# Altium project 200415 Brake Module R5.PrjPcb
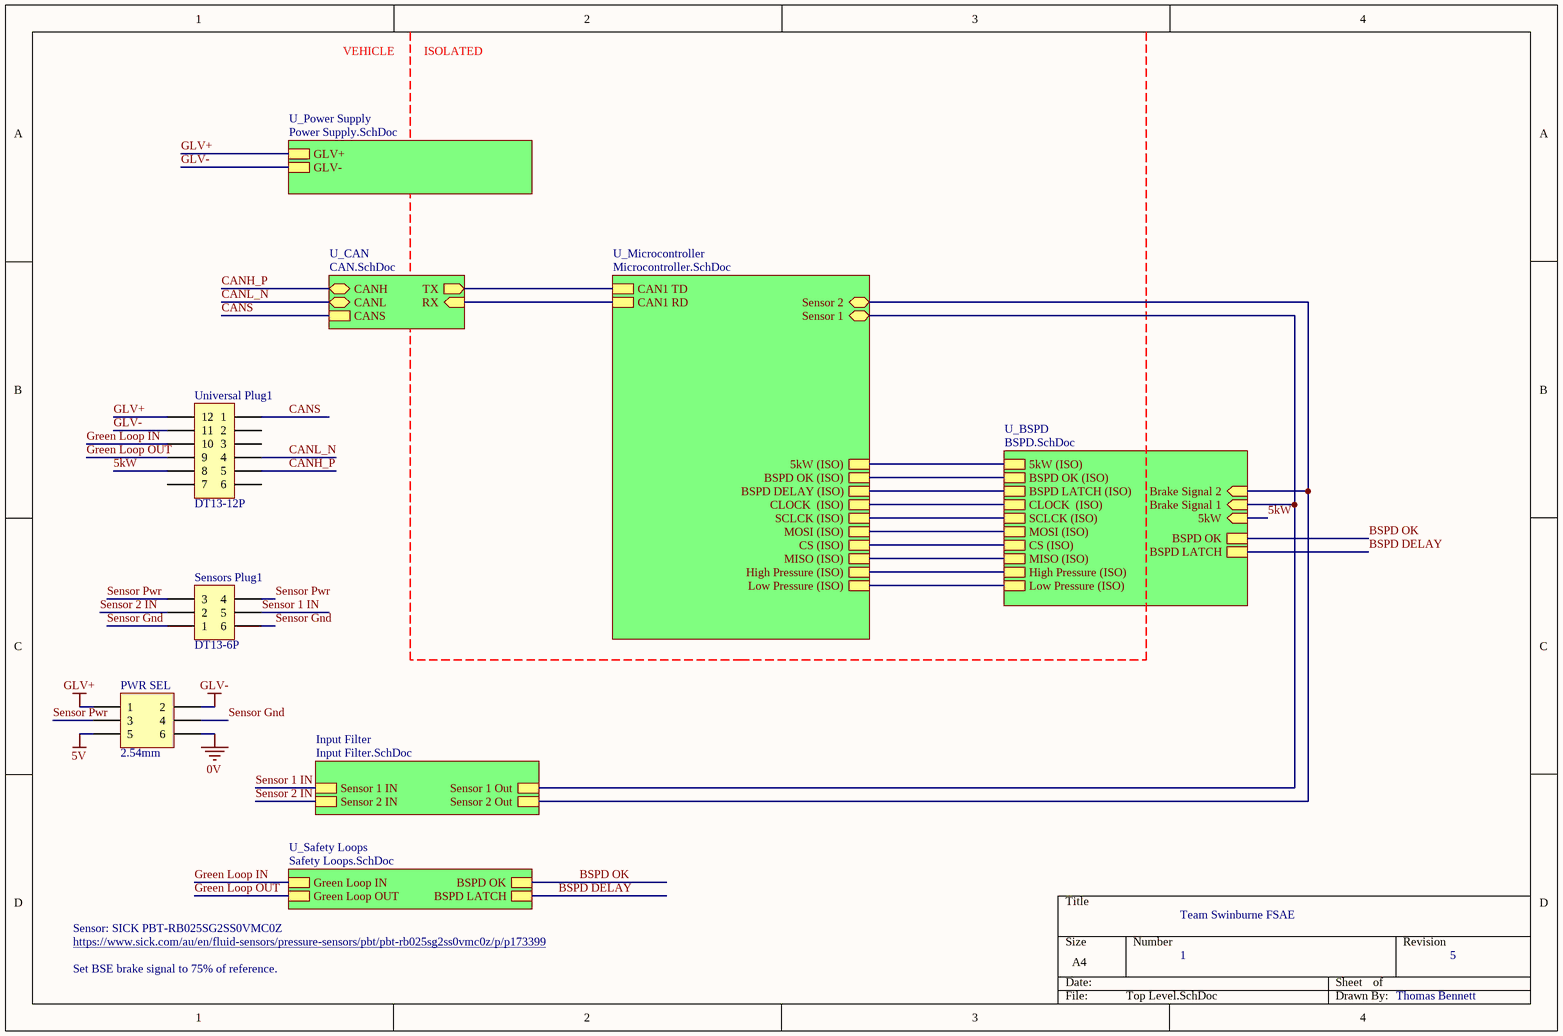
[diagram p0: Top Level.SchDoc]
_date: 06/05/2020; _designer: Thomas Bennett; _oganisation: Team Swinburne FSAE; _revision: 5
7 sheets, 139 parts. Net scope: hierarchical (ports join the sheet entries above them; power ports are global).
Board files: Brake Module PCB R5.PcbDoc, Brake Module R6.PcbDoc
Sheets:
  Top Level.SchDoc
    U_BSPD = BSPD.SchDoc
    U_Microcontroller = Microcontroller.SchDoc
    U_Safety Loops = Safety Loops.SchDoc
    U_Power Supply = Power Supply.SchDoc
    U_CAN = CAN.SchDoc
    Input Filter = Input Filter.SchDoc

## Sheet Top Level.SchDoc
size A4

### Parts
PWR_SEL  2.54mm  [TH 2.54mm Header 2x3]
Sensors_Plug1  DT13-6P  [DT13-6P]
Universal_Plug1  DT13-12P  [DT13-12P]

### Sub-sheets
Input Filter = Input Filter.SchDoc: Sensor 2 IN, Sensor 1 IN, Sensor 2 Out, Sensor 1 Out
U_BSPD = BSPD.SchDoc: BSPD OK (ISO), MOSI (ISO), SCLCK (ISO), 5kW (ISO), Brake Signal 1 (in), Brake Signal 2 (in), BSPD LATCH (ISO), 5kW (in), CLOCK  (ISO), CS (ISO), High Pressure (ISO), Low Pressure (ISO), BSPD OK, BSPD LATCH, MISO (ISO)
U_CAN = CAN.SchDoc: CANS, RX (in), CANL (bidir), CANH (bidir), TX (out)
U_Microcontroller = Microcontroller.SchDoc: BSPD OK (ISO), 5kW (ISO), Sensor 2 (bidir), Sensor 1 (bidir), BSPD DELAY (ISO), CAN1 RD, CAN1 TD, CLOCK  (ISO), High Pressure (ISO), Low Pressure (ISO), MISO (ISO), CS (ISO), MOSI (ISO), SCLCK (ISO)
U_Power Supply = Power Supply.SchDoc: GLV+, GLV-
U_Safety Loops = Safety Loops.SchDoc: Green Loop OUT, Green Loop IN, BSPD OK, BSPD LATCH

### Nets
0V: PWR_SEL.6
5V: PWR_SEL.5
GLV+: PWR_SEL.1 Universal_Plug1.12 ; sheet U_Power Supply/GLV+
GLV-: PWR_SEL.2 Universal_Plug1.11 ; sheet U_Power Supply/GLV-
5kW: Universal_Plug1.8 ; sheet U_BSPD/5kW
Brake Signal 1: sheet U_BSPD/Brake Signal 1, sheet U_Microcontroller/Sensor 1, sheet Input Filter/Sensor 1 Out
Brake Signal 2: sheet U_BSPD/Brake Signal 2, sheet U_Microcontroller/Sensor 2, sheet Input Filter/Sensor 2 Out
BSPD DELAY: sheet U_BSPD/BSPD LATCH, sheet U_Safety Loops/BSPD LATCH
BSPD OK: sheet U_BSPD/BSPD OK, sheet U_Safety Loops/BSPD OK
CANH_P: Universal_Plug1.5 ; sheet U_CAN/CANH
CANL_N: Universal_Plug1.4 ; sheet U_CAN/CANL
CANS: Universal_Plug1.1 ; sheet U_CAN/CANS
Green Loop IN: Universal_Plug1.10 ; sheet U_Safety Loops/Green Loop IN
Green Loop OUT: Universal_Plug1.9 ; sheet U_Safety Loops/Green Loop OUT
Sensor 1 IN: Sensors_Plug1.5 ; sheet Input Filter/Sensor 1 IN
Sensor 2 IN: Sensors_Plug1.2 ; sheet Input Filter/Sensor 2 IN
Sensor Gnd: PWR_SEL.4 Sensors_Plug1.1 Sensors_Plug1.6
Sensor Pwr: PWR_SEL.3 Sensors_Plug1.3 Sensors_Plug1.4
NetR13_1: sheet U_BSPD/MISO (ISO), sheet U_Microcontroller/MISO (ISO)
NetR14_1: sheet U_BSPD/MOSI (ISO), sheet U_Microcontroller/MOSI (ISO)
NetR15_1: sheet U_BSPD/SCLCK (ISO), sheet U_Microcontroller/SCLCK (ISO)
NetR16_1: sheet U_BSPD/CS (ISO), sheet U_Microcontroller/CS (ISO)
NetU1_4: sheet U_Microcontroller/CAN1 RD, sheet U_CAN/RX
NetU1_5: sheet U_Microcontroller/CAN1 TD, sheet U_CAN/TX
NetU5_11: sheet U_BSPD/BSPD OK (ISO), sheet U_Microcontroller/BSPD OK (ISO)
NetU5_13: sheet U_BSPD/CLOCK  (ISO), sheet U_Microcontroller/CLOCK  (ISO)
NetU5_14: sheet U_BSPD/BSPD LATCH (ISO), sheet U_Microcontroller/BSPD DELAY (ISO)
NetU6_11: sheet U_BSPD/Low Pressure (ISO), sheet U_Microcontroller/Low Pressure (ISO)
NetU6_13: sheet U_BSPD/High Pressure (ISO), sheet U_Microcontroller/High Pressure (ISO)
NetU6_14: sheet U_BSPD/5kW (ISO), sheet U_Microcontroller/5kW (ISO)

Not connected (* = marked no-connect by the designer): Universal_Plug1 2 3 6 7

### Notes on the sheet
- VEHICLE
- ISOLATED
- Sensor: SICK PBT-RB025SG2SS0VMC0Z
- https://www.sick.com/au/en/fluid-sensors/pressure-sensors/pbt/pbt-rb025sg2ss0vmc0z/p/p173399
- Set BSE brake signal to 75% of reference.
- 1

### Library data of the parts
PWR_SEL = TH 2.54mm Header 2x3: Positions: 6; Angle: 0; Flange: No; Contact: NA; Part Number: TH 2.54mm Header 2x3; Pitch: 2.54mm; Row Spacing: 2.54mm
Sensors_Plug1 = DT13-6P[[/\]]DT13-6P: Positions: 6; Pitch: 4.44mm; Row Spacing: 6.35mm; Angle: 90; Flange: Yes; Contact: Copper Alloy; Part Number: DT13-6P; Digikey Part Number: 1734-1025-ND; Digikey Link: https://www.digikey.com/product-detail/en/te-connectivity-deutsch-connectors/DT13-6P/1734-1025-ND/6566589
Universal_Plug1 = DT13-12P[[/\]]DT13-12P: Positions: 12; Pitch: 4.44mm; Row Spacing: 6.35mm; Angle: 90; Flange: Yes; Contact: Nickel; Part Number: DT13-12P; Digikey Part Number: 1734-1451-ND; Digikey Link: https://www.digikey.com.au/product-detail/en/te-connectivity-deutsch-connectors/DT13-12PA/1734-1451-ND/7220123

## Sheet BSPD.SchDoc: BSPD
size A3; DocumentNumber: 2; Revision: R5; SheetNumber: 2
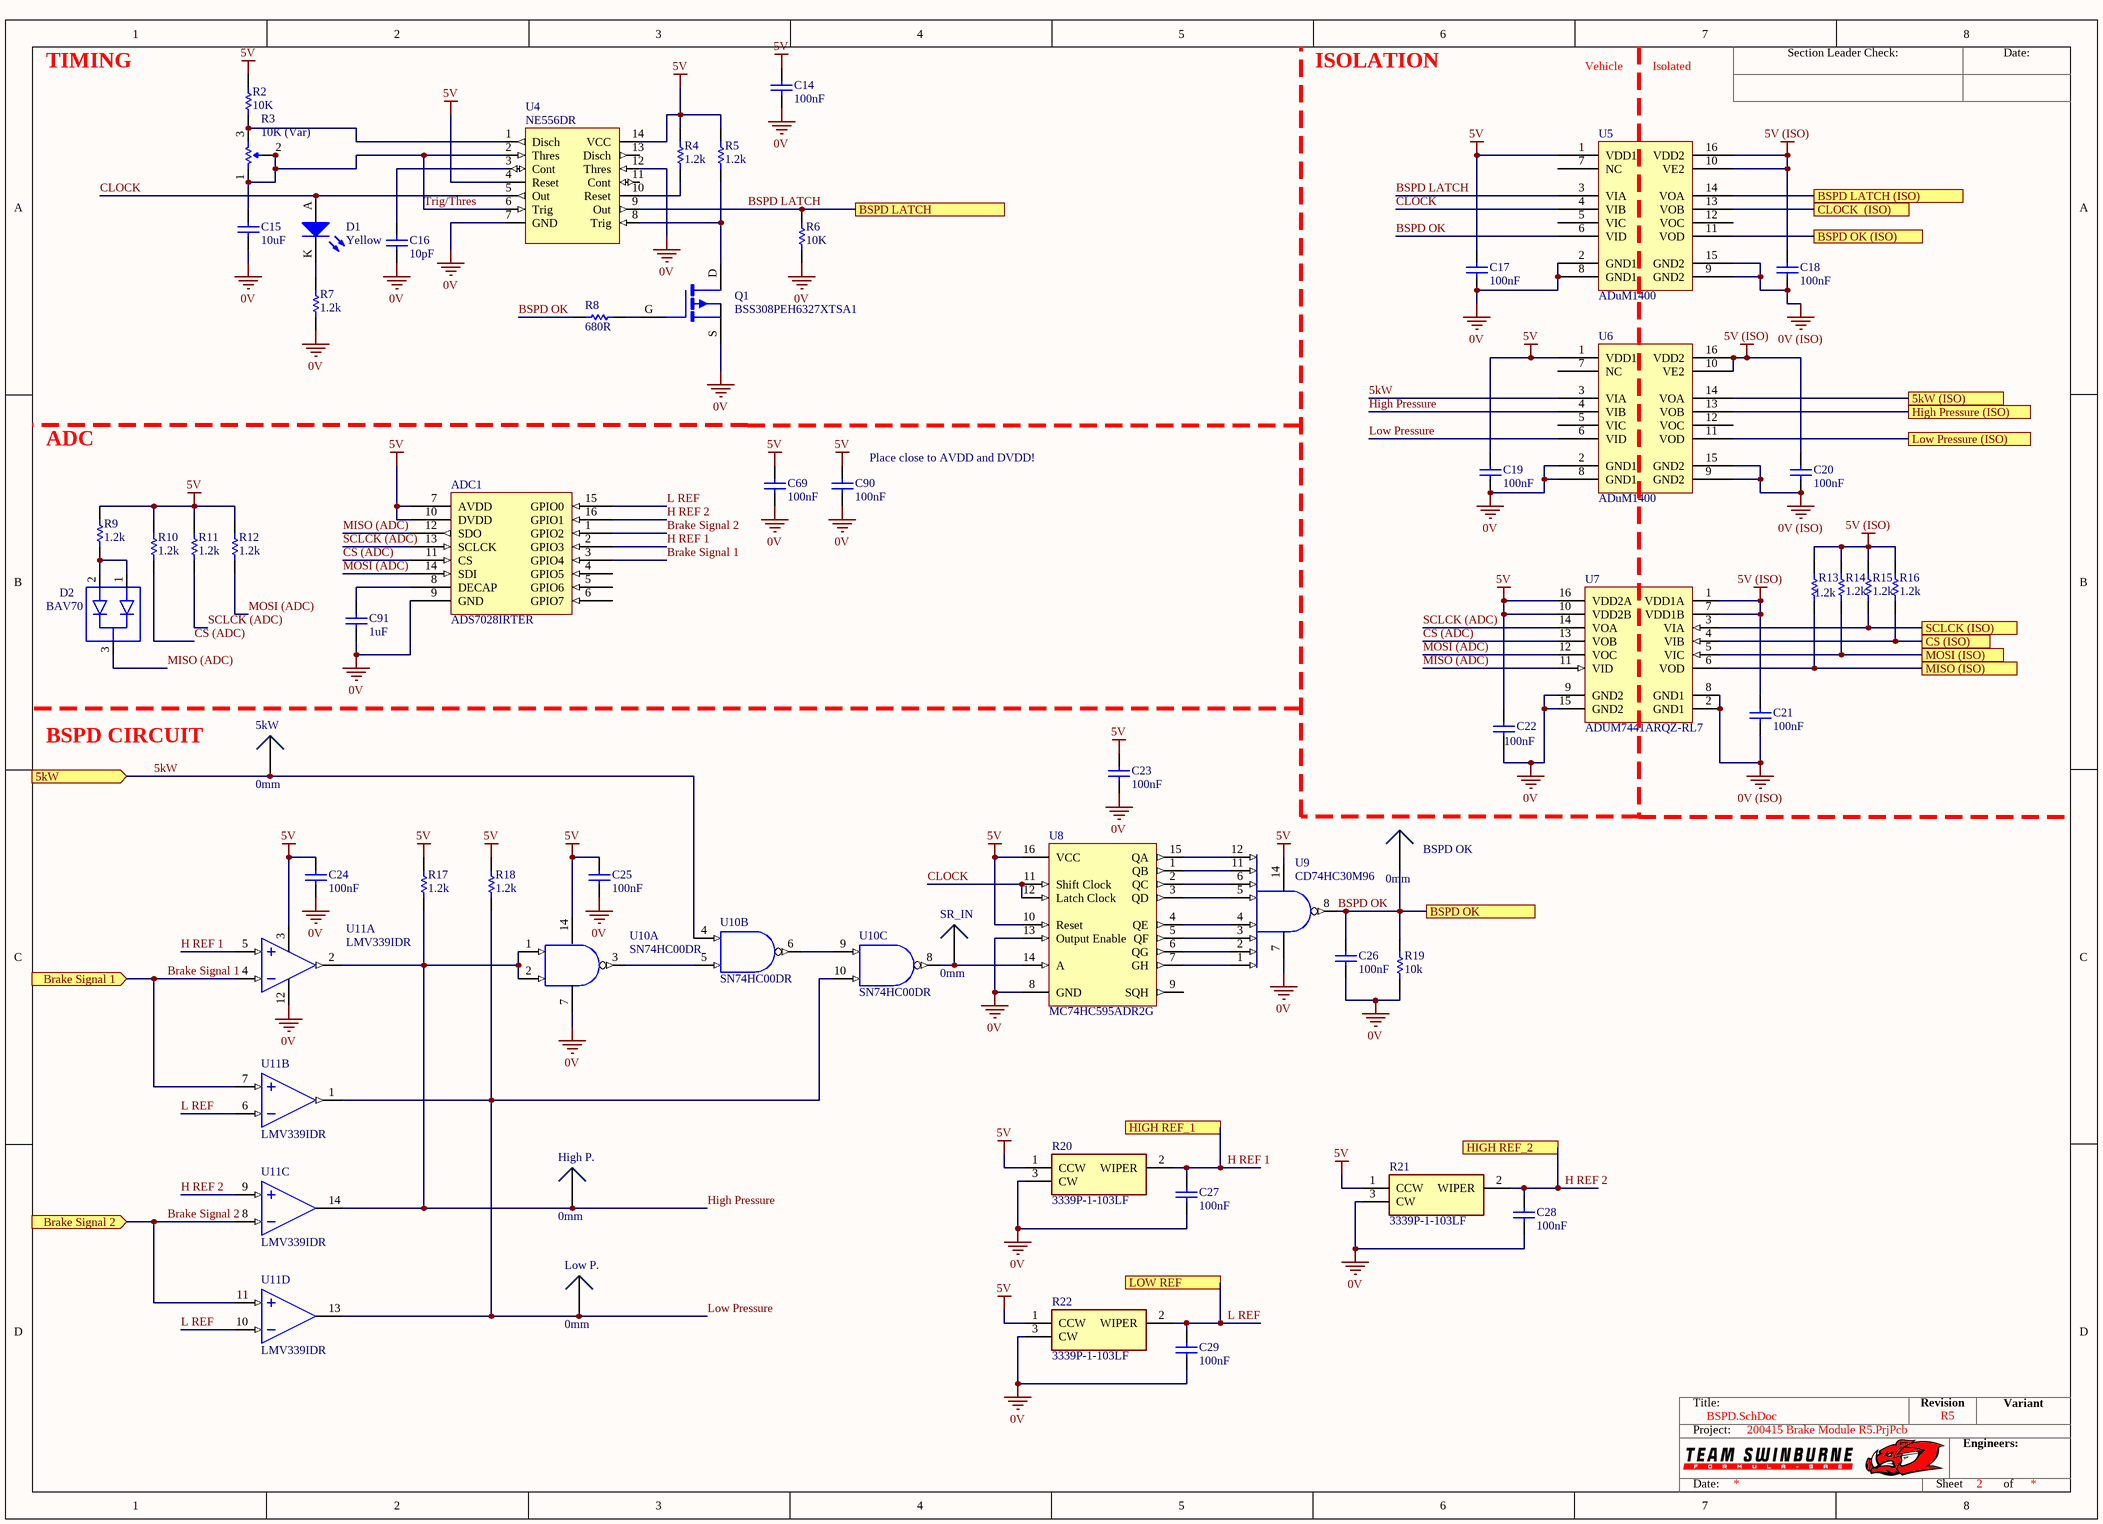
[diagram p1: BSPD.SchDoc]

### Parts
5kW  0mm  [SMD Test Point]
ADC1  ADS7028IRTER  [WFQN-16]
BSPD_OK  0mm  [SMD Test Point]
C14  100nF  [C0603]
C15  10uF  [C0603]
C16  10pF  [C0603]
C17  100nF  [C0603]
C18  100nF  [C0603]
C19  100nF  [C0603]
C20  100nF  [C0603]
C21  100nF  [C0603]
C22  100nF  [C0603]
C23  100nF  [C0603]
C24  100nF  [C0603]
C25  100nF  [C0603]
C26  100nF  [C0603]
C27  100nF  [0805]
C28  100nF  [0805]
C29  100nF  [0805]
C69  100nF  [C0603]
C90  100nF  [C0603]
C91  1uF  [0603]
D1  Yellow  [0805 LED]
D2  BAV70  [BAV70-Footprint-1]
High_P.  0mm  [SMD Test Point]
Low_P.  0mm  [SMD Test Point]
Q1  BSS308PEH6327XTSA1  [IN SOT-23 MOSFET]
R2  10K  [R0603]
R3  10K (Var)  [B 3296]
R4  1.2k  [R0603]
R5  1.2k  [R0603]
R6  10K  [R0603]
R7  1.2k  [R0603]
R8  680R  [R0603]
R9  1.2k  [R0603]
R10  1.2k  [R0603]
R11  1.2k  [R0603]
R12  1.2k  [R0603]
R13  1.2k  [R0603]
R14  1.2k  [R0603]
R15  1.2k  [R0603]
R16  1.2k  [R0603]
R17  1.2k  [R0603]
R18  1.2k  [R0603]
R19  10k  [0805]
R20  3339P-1-103LF  [3339P1103LF]
R21  3339P-1-103LF  [3339P1103LF]
R22  3339P-1-103LF  [3339P1103LF]
SR_IN  0mm  [SMD Test Point]
U4  NE556DR  [14 SOIC]
U5  ADuM1400  [SOIC16-W]
U6  ADuM1400  [SOIC16-W]
U7  ADUM7441ARQZ-RL7  [ADI-RQ-16_M]
U8  MC74HC595ADR2G  [ON 16-SOIC]
U9  CD74HC30M96  [TI 14-SOIC]
U10  SN74HC00DR  [TI 14-SOIC]  (parts A,B,C of 4)
U11  LMV339IDR  [TI 14-SOIC]  (parts A,B,C,D of 4)

### Ports
5kW (in), 5kW (ISO), Brake Signal 1 (in), Brake Signal 2 (in), BSPD LATCH, BSPD LATCH (ISO), BSPD OK, BSPD OK (ISO), CLOCK  (ISO), CS (ISO), High Pressure (ISO), HIGH REF_1, HIGH REF_2, Low Pressure (ISO), LOW REF, MISO (ISO), MOSI (ISO), SCLCK (ISO)

### Nets
0V: ADC1.9(GND) C14.1 C15.1 C16.1 C17.1 C19.1 C22.1 C23.1 C24.1 C25.1 C26.1 C27.1 C28.1 C29.1 C69.1 C90.1 C91.1 Q1.S R6.1 R7.1 R19.1 R20.3(CW) R21.3(CW) R22.3(CW) U4.7(GND) U4.12(Thres) U5.2(GND1) U5.8(GND1) U6.2(GND1) U6.8(GND1) U7.9(GND2) U7.15(GND2) U8.8(GND) U8.13(Output_Enable) U9.7(GND) U10.7(GND) U11.12(V-)
0V (ISO): C18.1 C20.1 C21.1 U5.9(GND2) U5.15(GND2) U6.9(GND2) U6.15(GND2) U7.2(GND1) U7.8(GND1)
5V: ADC1.7(AVDD) ADC1.10(DVDD) C14.2 C17.2 C19.2 C22.2 C23.2 C24.2 C25.2 C69.2 C90.2 R2.2 R4.2 R5.2 R9.2 R10.2 R11.2 R12.2 R17.2 R18.2 R20.1(CCW) R21.1(CCW) R22.1(CCW) U4.4(Reset) U4.14(VCC) U5.1(VDD1) U6.1(VDD1) U7.10(VDD2B) U7.16(VDD2A) U8.10(Reset) U8.16(VCC) U9.14(VCC) U10.14(VCC) U11.3(V+)
5V (ISO): C18.2 C20.2 C21.2 R13.2 R14.2 R15.2 R16.2 U5.10(VE2) U5.16(VDD2) U6.10(VE2) U6.16(VDD2) U7.1(VDD1A) U7.7(VDD1B)
5kW: 5kW.1 U6.3(VIA) U10.4(2A) ; port 5kW
Brake Signal 1: ADC1.3(GPIO4) U11.4(IN_A-) U11.7(IN_B+) ; port Brake Signal 1
Brake Signal 2: ADC1.1(GPIO2) U11.8(IN_C-) U11.11(IN_D+) ; port Brake Signal 2
BSPD LATCH: R6.2 U4.9(Out) U5.3(VIA) ; port BSPD LATCH  [project net BSPD DELAY]
BSPD OK: BSPD_OK.1 C26.2 R8.1 R19.2 U5.6(VID) U9.8(Output) ; port BSPD OK
CLOCK: D1.A U4.5(Out) U5.4(VIB) U8.11(Shift_Clock) U8.12(Latch_Clock)
CS (ADC): ADC1.11(CS) R10.1 U7.13(VOB)
H REF 1: ADC1.2(GPIO3) C27.2 R20.2(WIPER) U11.5(IN_A+) ; port HIGH REF_1
H REF 2: ADC1.16(GPIO1) C28.2 R21.2(WIPER) U11.9(IN_C+) ; port HIGH REF_2
High Pressure: High_P..1 R17.1 U6.4(VIB) U10.1(1A) U10.2(1B) U11.2(OUT_A) U11.14(OUT_C)
L REF: ADC1.15(GPIO0) C29.2 R22.2(WIPER) U11.6(IN_B-) U11.10(IN_D-) ; port LOW REF
Low Pressure: Low_P..1 R18.1 U6.6(VID) U10.10(3B) U11.1(OUT_B) U11.13(OUT_D)
MISO (ADC): ADC1.12(SDO) D2.3(CC) U7.11(VID)
MOSI (ADC): ADC1.14(SDI) R12.1 U7.12(VOC)
SCLCK (ADC): ADC1.13(SCLCK) R11.1 U7.14(VOA)
Trig/Thres: C15.2 R3.1(CCW) R3.2(Wiper) U4.2(Thres) U4.6(Trig)
NetADC1_8: ADC1.8(DECAP) C91.2
NetC16_2: C16.2 U4.3(Cont)
NetD1_K: D1.K R7.2
NetD2_1: D2.1(A1) D2.2(A2) R9.1
NetQ1_D: Q1.D R5.1 U4.8(Trig)
NetQ1_G: Q1.G R8.2
NetR2_1: R2.1 R3.3(CW) U4.1(Disch)
NetR4_1: R4.1 U4.10(Reset)
NetR13_1: R13.1 U7.6(VOD) ; port MISO (ISO)
NetR14_1: R14.1 U7.5(VIC) ; port MOSI (ISO)
NetR15_1: R15.1 U7.3(VIA) ; port SCLCK (ISO)
NetR16_1: R16.1 U7.4(VIB) ; port CS (ISO)
NetSR_IN_1: SR_IN.1 U8.14(A) U10.8(3Y)
NetU5_11: U5.11(VOD) ; port BSPD OK (ISO)
NetU5_13: U5.13(VOB) ; port CLOCK  (ISO)
NetU5_14: U5.14(VOA) ; port BSPD LATCH (ISO)
NetU6_11: U6.11(VOD) ; port Low Pressure (ISO)
NetU6_13: U6.13(VOB) ; port High Pressure (ISO)
NetU6_14: U6.14(VOA) ; port 5kW (ISO)
NetU8_1: U8.1(QB) U9.11(Input)
NetU8_2: U8.2(QC) U9.6(Input)
NetU8_3: U8.3(QD) U9.5(Input)
NetU8_4: U8.4(QE) U9.4(Input)
NetU8_5: U8.5(QF) U9.3(Input)
NetU8_6: U8.6(QG) U9.2(Input)
NetU8_7: U8.7(GH) U9.1(Input)
NetU8_15: U8.15(QA) U9.12(Input)
NetU10_3: U10.3(1Y) U10.5(2B)
NetU10_6: U10.6(2Y) U10.9(3A)

Not connected (* = marked no-connect by the designer): ADC1 4(GPIO5) 5(GPIO6) 6(GPIO7); U4 11(Cont) 13(Disch); U5 5(VIC) 7(NC) 12(VOC); U6 5(VIC) 7(NC) 12(VOC); U8 9(SQH)

### Notes on the sheet
- TIMING
- ISOLATION
- Vehicle
- Isolated
- ADC
- (near C90) Place close to AVDD and DVDD!
- BSPD CIRCUIT
- Section Leader Check:
- Date:
- Title:
- Revision
- Variant
- Project:
- Engineers:
- Sheet
- of

### Library data of the parts
5kW BSPD_OK High_P. Low_P. SR_IN = SMD Test Point: Positions: 1; Row Spacing: 0; Flange: No; Contact: NA; Part Number: SMD Test Point; Pitch: 0mm; Angle: 0
ADC1 = ADS7028IRTER: IC ADC 12BIT SAR 16WQFN; Manufacturer: Texas Instruments; Part Number: ADS7028IRTER; Digikey Part Number: ADS7028IRTER; Digikey Link: https://www.digikey.com.au/en/products/detail/texas-instruments/ADS7028IRTER/12696020?s=N4IgTCBcDaIIIBEDKB2ADGAHASQEoBUBRXEAXQF8g
C14 C17-C26 C69 C90 = CC0603ZPY5V9BB104: Tolerance: 5%; Material: C0G; Rated Voltage: 50V; Part Number: CC0603ZPY5V9BB104; Value: 100nF; Digikey Link: #https://www.digikey.com.au/en/products/detail/yageo/CC0603ZPY5V9BB104/11490657#
C15 = GRM188R6YA106MA73D: Tolerance: 20%; Material: X5R; Rated Voltage: 35V; Part Number: GRM188R6YA106MA73D; Value: 10uF; Digikey Link: #https://www.digikey.com.au/en/products/detail/murata-electronics/GRM188R6YA106MA73D/5877411#
C16 = CC0603JPNPO9BN100: Tolerance: 5%; Material: C0G; Rated Voltage: 50V; Part Number: CC0603JPNPO9BN100; Value: 10pF; Digikey Link: #https://www.digikey.com.au/en/products/detail/yageo/CC0603JPNPO9BN100/11491009#
C27-C29 = GCM21BR71H104KA37L: Manufacturer: muRata; Tolerance: ±10%; Material: X7R; Rated Voltage: 50V; Part Number: GCM21BR71H104KA37L; Value: 100nF; Digikey Part Number: 490-6064-1-ND
C91 = GRT188R61H105ME13D: Manufacturer: muRata; Tolerance: 20%; Material: X5R; Rated Voltage: 50V; Part Number: GRT188R61H105ME13D; Value: 1uF; Digikey Part Number: GRT188R61H105ME13D
D1 = SML-211YTT86: Yellow LED Indication - Discrete 1.75V 0805 (2012 Metric); Manufacturer: ROHM Semiconductor; Part Number: SML-211YTT86; Colour: Yellow; Digikey Part Number: 511-1293-1-ND; Digikey Link: https://www.digikey.com/product-detail/en/rohm-semiconductor/SML-211YTT86/511-1293-1-ND/637106
D2 = CMP-004-00001-1: DIODE ARRAY GP 70V 200mA SOT23-3; RoHS Compliant: No
Q1 = BSS308PEH6327XTSA1: P-Channel 30V 2A (Ta) 500mW (Ta) Surface Mount SOT-23-3; Manufacturer: Infineon Technologies; Published: 24-Mar-1999; LatestRevisionDate: 29-May-2009; LatestRevisionNote: IPC-7351 Footprint Added.; PackageVersion: Sep-2000; PackageReference: SOT-343; Publisher: Altium Limited; PackageDescription: 4-Pin SOT-343 Package 1.3 mm Pitch, 2.1 mm Lead Span; Part Number: BSS308PEH6327XTSA1; Digikey Part Number: BSS308PEH6327XTSA1CT-ND; Digikey Link: https://www.digikey.com/product-detail/en/infineon-technologies/BSS308PEH6327XTSA1/BSS308PEH6327XTSA1CT-ND/3196649
R2 R6 = RA73F1J10KBTD: Tolerance: 0.1%; Part Number: RA73F1J10KBTD; Value: 10K; Material: Thin Film; Digikey Link: #https://www.digikey.com.au/en/products/detail/te-connectivity-passive-product/RA73F1J10KBTD/16031729#
R3 = 3296W-1-103LF: Manufacturer: Bournes Inc; Tolerance: 0.1; Rated Voltage: 0.5W; Part Number: 3296W-1-103LF; Value: 10K (Var); Digikey Part Number: 3296W-103LF-ND
R4 R5 R7 R9-R18 = ERJ-PA3J122V: Tolerance: 1%; Part Number: ERJ-PA3J122V; Value: 1.2k; Material: Thick Film; Digikey Link: #https://www.digikey.com.au/en/products/detail/panasonic-electronic-components/ERJ-PA3J122V/5035981#
R8 = RCP0603B680RGEA: Tolerance: 2%; Part Number: RCP0603B680RGEA; Value: 680R; Material: Thick Film; Digikey Link: #https://www.digikey.com.au/en/products/detail/vishay-dale/RCP0603B680RGEA/5791729#
R19 = RC0805FR0710KL: Manufacturer: YAGEO; Tolerance: 0.01; Rated Voltage: 0.125W; Part Number: RC0805FR0710KL; Value: 10k; Material: FR-07; Digikey Part Number: 311-10.0KCRCT-ND
R20-R22 = 3339P-1-103LF: Variable Resistor; Manufacturer_Name: Bourns; Datasheet Link: http://www.bourns.com/docs/Product-Datasheets/3339.pdf; Height: 6.6mm; Manufacturer_Part_Number: 3339P-1-103LF; Mouser Part Number: 652-3339P-1-103LF; Mouser Price/Stock: https://www.mouser.co.uk/ProductDetail/Bourns/3339P-1-103LF?qs=pSi0RBzb0oq3DckZs1IQyg%3D%3D; Arrow Part Number: 3339P-1-103LF; Arrow Price/Stock: https://www.arrow.com/en/products/3339p-1-103lf/bourns?region=nac
U4 = NE556DR: IC OSC TIMER DUAL 100KHZ 14SOIC; Manufacturer: Texas Instruments; Part Number: NE556DR; Digikey Part Number: 296-26240-1-ND; Digikey Link: https://www.digikey.com/product-detail/en/texas-instruments/NE556DR/296-26240-1-ND/2254905
U5 U6 = ADuM1400: DIGITAL ISOLATOR, QUAD CHANNEL; Part Number: ADuM1400; Digikey Link: #https://www.analog.com/media/en/technical-documentation/data-sheets/ADuM1400_1401_1402.pdf#
U7 = CMP-001-0005-5: Digital Isolator CMOS 4-CH 1Mbps 16-Pin QSOP T/R; Pulse Width Distortion (PWD): 25ns; Nominal Supply Current: 4.1mA; Data Rate: 25Mbps; Turn-On Delay Time: 56ns; Max Supply Voltage: 5.5V; Isolated Power: No; Min Supply Voltage: 3V; Propagation Delay: 75ns; Channel Type: Unidirectional; Number of Channels: 4; Lead Free: Contains Lead; Number of Pins: 16; Contact Plating: Tin,Matte; RoHS Compliant: Yes; Package Quantity: 1000; Type: General Purpose; Supply Current: 4.1mA; Case/Package: QSOP; Max Operating Temperature: 105°C; Packaging: Tape and Reel; Series: iCoupler®; Min Operating Temperature: -40°C
U8 = MC74HC595ADR2G: IC SHIFT REGISTR 8BIT 3ST 16SOIC; Manufacturer: ON Semiconductor; Part Number: MC74HC595ADR2G; Digikey Part Number: MC74HC595ADR2GOSCT-ND; Digikey Link: https://www.digikey.com/product-detail/en/on-semiconductor/MC74HC595ADR2G/MC74HC595ADR2GOSCT-ND/1139727
U9 = CD74HC30M96: IC GATE NAND 1CH 8-INP 14SOIC; Manufacturer: Texas Instruments; Part Number: CD74HC30M96; Digikey Part Number: 296-14521-1-ND; Digikey Link: https://www.digikey.com/product-detail/en/texas-instruments/CD74HC30M96/296-14521-1-ND/555580
U10 = SN74HC00DR: NAND Gate IC 4 Channel 14-SOIC; Manufacturer: Texas Instruments; Part Number: SN74HC00DR; Digikey Part Number: 296-1187-2-ND; Digikey Link: https://www.digikey.com.au/product-detail/en/texas-instruments/SN74HC00DR/296-1187-2-ND/276830
U11 = LMV339IDR: Comparator General Purpose Open Collector 14-SOIC; Manufacturer: Texas Instruments; Part Number: LMV339IDR; Digikey Part Number: 296-6611-2-ND; Digikey Link: https://www.digikey.com/product-detail/en/texas-instruments/LMV339MTX-NOPB/296-35446-1-ND/3739150

## Sheet Microcontroller.SchDoc
size A3
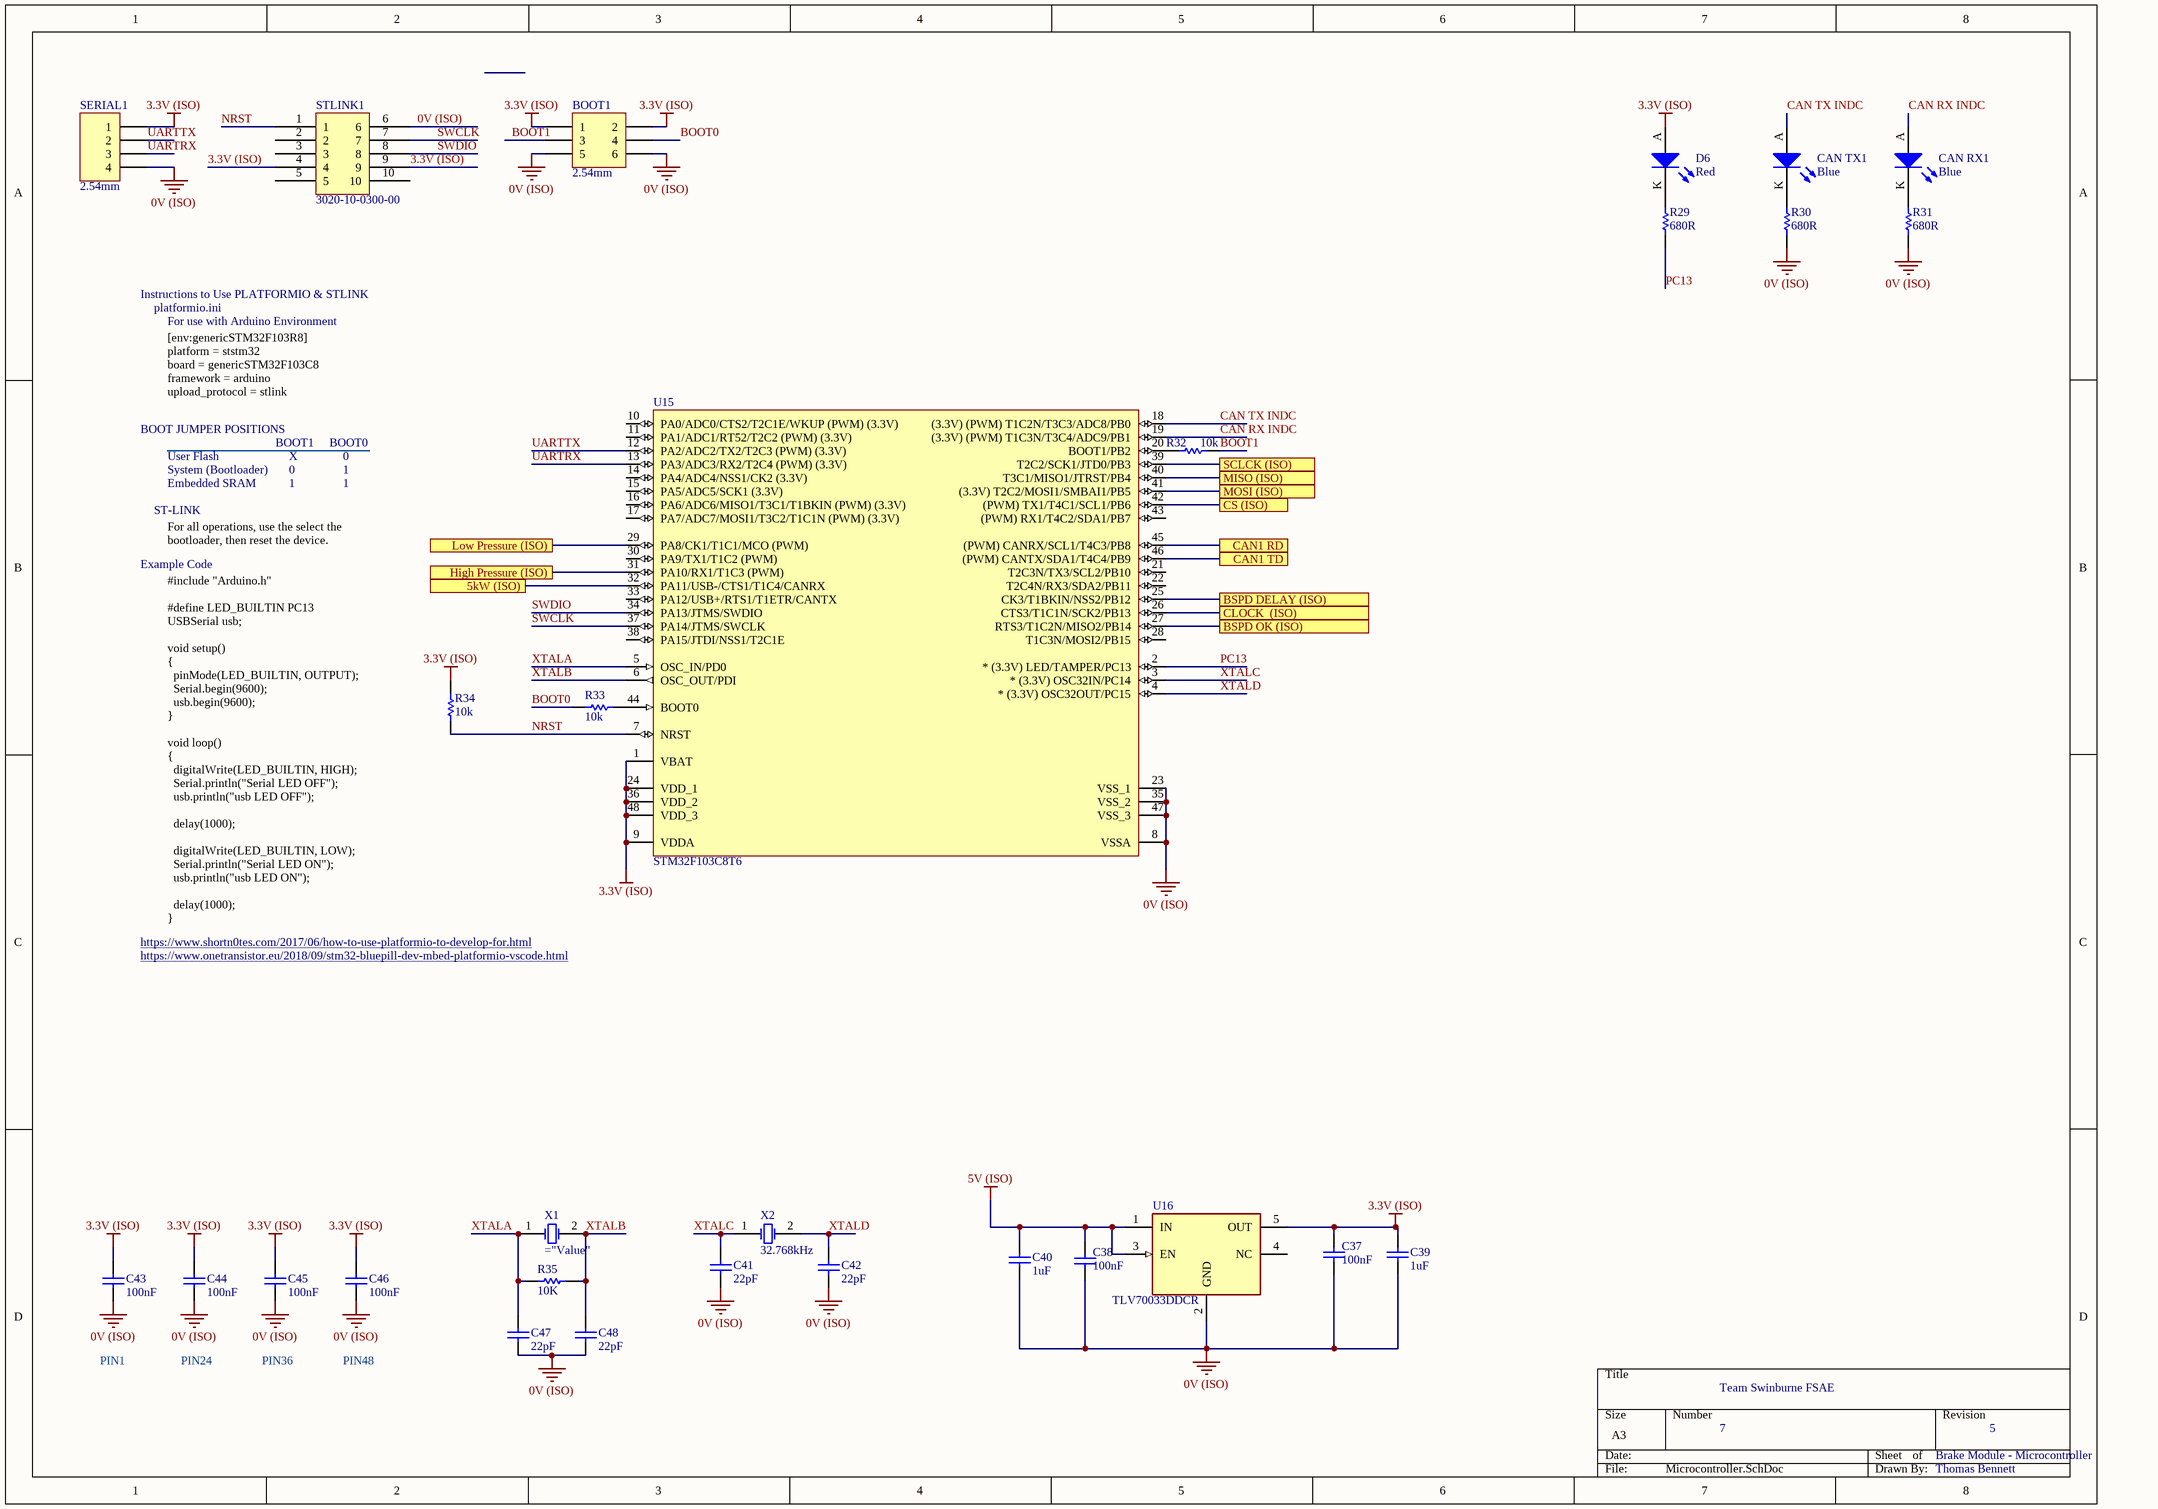
[diagram p2: Microcontroller.SchDoc]

### Parts
BOOT1  2.54mm  [TH 2.54mm Header 2x3]
C37  100nF  [C0603]
C38  100nF  [C0603]
C39  1uF  [0603]
C40  1uF  [0603]
C41  22pF  [C0603]
C42  22pF  [C0603]
C43  100nF  [C0603]
C44  100nF  [C0603]
C45  100nF  [C0603]
C46  100nF  [C0603]
C47  22pF  [C0603]
C48  22pF  [C0603]
CAN_RX1  Blue  [0805 LED]
CAN_TX1  Blue  [0805 LED]
D6  Red  [0805 LED]
R29  680R  [R0603]
R30  680R  [R0603]
R31  680R  [R0603]
R32  10k  [0805]
R33  10k  [0805]
R34  10k  [0805]
R35  10K  [R0603]
SERIAL1  2.54mm  [TH 2.54mm Header 1x4]
STLINK1  3020-10-0300-00  [3020-10-0300-00]
U15  STM32F103C8T6  [STM 48-LQFP]
U16  TLV70033DDCR  [FP-DDC0005A-IPC_B]
X1  (no value)  [ECS-80-18-30-JGN-TR]
X2  32.768kHz  [EPSON 2-SMD]

### Ports
5kW (ISO), BSPD DELAY (ISO), BSPD OK (ISO), CAN1 RD, CAN1 TD, CLOCK  (ISO), CS (ISO), High Pressure (ISO), Low Pressure (ISO), MISO (ISO), MOSI (ISO), SCLCK (ISO)

### Nets
0V (ISO): BOOT1.5 BOOT1.6 C37.1 C38.1 C39.1 C40.1 C41.1 C42.1 C43.1 C44.1 C45.1 C46.1 C47.1 C48.1 R30.2 R31.2 SERIAL1.4 STLINK1.6 U15.8(VSSA) U15.23(VSS_1) U15.35(VSS_2) U15.47(VSS_3) U16.2(GND)
3.3V (ISO): BOOT1.1 BOOT1.2 C37.2 C39.2 C43.2 C44.2 C45.2 C46.2 D6.A R34.2 SERIAL1.1 STLINK1.4 STLINK1.9 U15.1(VBAT) U15.9(VDDA) U15.24(VDD_1) U15.36(VDD_2) U15.48(VDD_3) U16.5(OUT)
5V (ISO): C38.2 C40.2 U16.1(IN) U16.3(EN)
BOOT0: BOOT1.4 R33.1
BOOT1: BOOT1.3 R32.2
CAN RX INDC: CAN_RX1.A U15.19((3.3V)_(PWM)_T1C3N/T3C4/ADC9/PB1)
CAN TX INDC: CAN_TX1.A U15.18((3.3V)_(PWM)_T1C2N/T3C3/ADC8/PB0)
NRST: R34.1 STLINK1.1 U15.7(NRST)
PC13: R29.2 U15.2(*_(3.3V)_LED/TAMPER/PC13)
SWCLK: STLINK1.7 U15.37(PA14/JTMS/SWCLK)
SWDIO: STLINK1.8 U15.34(PA13/JTMS/SWDIO)
UARTRX: SERIAL1.3 U15.13(PA3/ADC3/RX2/T2C4_(PWM)_(3.3V))
UARTTX: SERIAL1.2 U15.12(PA2/ADC2/TX2/T2C3_(PWM)_(3.3V))
XTALA: C47.2 R35.1 U15.5(OSC_IN/PD0) X1.1(OSC1)
XTALB: C48.2 R35.2 U15.6(OSC_OUT/PDI) X1.2(OSC2)
XTALC: C41.2 U15.3(*_(3.3V)_OSC32IN/PC14) X2.1(OSC1)
XTALD: C42.2 U15.4(*_(3.3V)_OSC32OUT/PC15) X2.2(OSC2)
NetCAN_RX1_K: CAN_RX1.K R31.1
NetCAN_TX1_K: CAN_TX1.K R30.1
NetD6_K: D6.K R29.1
NetR13_1: U15.40(T3C1/MISO1/JTRST/PB4) ; port MISO (ISO)
NetR14_1: U15.41((3.3V)_T2C2/MOSI1/SMBAI1/PB5) ; port MOSI (ISO)
NetR15_1: U15.39(T2C2/SCK1/JTD0/PB3) ; port SCLCK (ISO)
NetR16_1: U15.42((PWM)_TX1/T4C1/SCL1/PB6) ; port CS (ISO)
NetR32_1: R32.1 U15.20(BOOT1/PB2)
NetR33_2: R33.2 U15.44(BOOT0)
NetU1_4: U15.45((PWM)_CANRX/SCL1/T4C3/PB8) ; port CAN1 RD
NetU1_5: U15.46((PWM)_CANTX/SDA1/T4C4/PB9) ; port CAN1 TD
NetU5_11: U15.27(RTS3/T1C2N/MISO2/PB14) ; port BSPD OK (ISO)
NetU5_13: U15.26(CTS3/T1C1N/SCK2/PB13) ; port CLOCK  (ISO)
NetU5_14: U15.25(CK3/T1BKIN/NSS2/PB12) ; port BSPD DELAY (ISO)
NetU6_11: U15.29(PA8/CK1/T1C1/MCO_(PWM)) ; port Low Pressure (ISO)
NetU6_13: U15.31(PA10/RX1/T1C3_(PWM)) ; port High Pressure (ISO)
NetU6_14: U15.32(PA11/USB-/CTS1/T1C4/CANRX) ; port 5kW (ISO)

Not connected (* = marked no-connect by the designer): STLINK1 2 3 5 10; U15 10(PA0/ADC0/CTS2/T2C1E/WKUP_(PWM)_(3.3V)) 11(PA1/ADC1/RT52/T2C2_(PWM)_(3.3V)) 14(PA4/ADC4/NSS1/CK2_(3.3V)) 15(PA5/ADC5/SCK1_(3.3V)) 16(PA6/ADC6/MISO1/T3C1/T1BKIN_(PWM)_(3.3V)) 17(PA7/ADC7/MOSI1/T3C2/T1C1N_(PWM)_(3.3V)) 21(T2C3N/TX3/SCL2/PB10) 22(T2C4N/RX3/SDA2/PB11) 28(T1C3N/MOSI2/PB15) 30(PA9/TX1/T1C2_(PWM)) 33(PA12/USB+/RTS1/T1ETR/CANTX) 38(PA15/JTDI/NSS1/T2C1E) 43((PWM)_RX1/T4C2/SDA1/PB7); U16 4(NC)

### Notes on the sheet
- Instructions to Use PLATFORMIO & STLINK
- platformio.ini
- For use with Arduino Environment
- BOOT JUMPER POSITIONS
- [env:genericSTM32F103R8]
  platform = ststm32
  board = genericSTM32F103C8
  framework = arduino
  upload_protocol = stlink
- BOOT1
- BOOT0
- ST-LINK
- User Flash
- System (Bootloader)
- Embedded SRAM
- X
- 1
- 0
- Example Code
- For all operations, use the select the bootloader, then reset the device.
- #include "Arduino.h"
  #define LED_BUILTIN PC13
  USBSerial usb;
  void setup()
  {
  pinMode(LED_BUILTIN, OUTPUT);
  Serial.begin(9600);
  usb.begin(9600);
  }
  void loop()
  {
  digitalWrite(LED_BUILTIN, HIGH);
  Serial.println("Serial LED OFF");
  usb.println("usb LED OFF");
  delay(1000);
  digitalWrite(LED_BUILTIN, LOW);
  Serial.println("Serial LED ON");
  usb.println("usb LED ON");
  delay(1000);
  }
- https://www.shortn0tes.com/2017/06/how-to-use-platformio-to-develop-for.html
- https://www.onetransistor.eu/2018/09/stm32-bluepill-dev-mbed-platformio-vscode.html
- PIN1
- PIN24
- PIN36
- PIN48
- 7
- Brake Module - Microcontroller
- Title
- Size:
- Date:
- A3
- Number:
- Time:
- Revision:
- Sheet
- of
- File:
- (in symbol RC0805FR0710KL) 0805

### Library data of the parts
BOOT1 = TH 2.54mm Header 2x3: as PWR_SEL on sheet Top Level; Part Number: TH 2.54mm Header 2x3; Pitch: 2.54mm; Row Spacing: 2.54mm
C37 C38 C43-C46 = CC0603ZPY5V9BB104: as C14 on sheet BSPD; Part Number: CC0603ZPY5V9BB104; Digikey Link: #https://www.digikey.com.au/en/products/detail/yageo/CC0603ZPY5V9BB104/11490657#; Value: 100nF
C39 C40 = GRT188R61H105ME13D: as C91 on sheet BSPD; Part Number: GRT188R61H105ME13D; Value: 1uF; Digikey Part Number: GRT188R61H105ME13D
C41 C42 C47 C48 = CC0603JPNPO9BN220: Tolerance: 5%; Material: C0G; Rated Voltage: 50V; Part Number: CC0603JPNPO9BN220; Value: 22pF; Digikey Link: #https://www.digikey.com.au/en/products/detail/yageo/CC0603JPNPO9BN220/11490454#
CAN_RX1 CAN_TX1 = SML-MN2BCTT86C: LED BLUE CLEAR 2012 SMD; Manufacturer: ROHM Semiconductor; Part Number: SML-MN2BCTT86C; Colour: Blue; Digikey Part Number: 846-1207-1-ND; Digikey Link: https://www.digikey.com/product-detail/en/rohm-semiconductor/SMLMN2BCTT86C/846-1207-1-ND/6057239
D6 = SML-210LTT86: Red LED Indication - Discrete 1.75V 0805 (2012 Metric); Manufacturer: ROHM Semiconductor; Part Number: SML-210LTT86; Colour: Red; Digikey Part Number: 511-1286-1-ND; Digikey Link: https://www.digikey.com/product-detail/en/rohm-semiconductor/SML-210LTT86/511-1286-1-ND/637099
R29-R31 = RCP0603B680RGEA: Tolerance: 2%; Part Number: RCP0603B680RGEA; Value: 680R; Material: Thick Film; Digikey Link: #https://www.digikey.com.au/en/products/detail/vishay-dale/RCP0603B680RGEA/5791729#
R32-R34 = RC0805FR0710KL: as R19 on sheet BSPD; Part Number: RC0805FR0710KL; Value: 10k; Material: FR-07; Digikey Part Number: 311-10.0KCRCT-ND
R35 = RA73F1J10KBTD: Tolerance: 0.1%; Part Number: RA73F1J10KBTD; Value: 10K; Material: Thin Film; Digikey Link: #https://www.digikey.com.au/en/products/detail/te-connectivity-passive-product/RA73F1J10KBTD/16031729#
SERIAL1 = TH 2.54mm Header 1x4: Positions: 4; Angle: 0; Flange: No; Contact: NA; Part Number: TH 2.54mm Header 1x4; Pitch: 2.54mm; Row Spacing: 2.54mm
STLINK1 = 3020-10-0300-00: Header SMD 2.54mm 2x05; Part Number: 3020-10-0300-00; Digikey Link: #https://www.digikey.com.au/en/products/detail/cnc-tech/3020-10-0300-00/3441727#
U15 = STM32F103C8T6: ARM® Cortex®-M3 STM32F1 Microcontroller IC 32-Bit 72MHz 64KB (64K x 8) FLASH; Manufacturer: STMicroelectronics; Part Number: STM32F103C8T6; Digikey Part Number: 497-6063-ND; Digikey Link: https://www.digikey.com/product-detail/en/stmicroelectronics/STM32F103C8T6/497-6063-ND/1646338
U16 = CMP-001-0011-2: Fixed Positive LDO Regulator, 3.3V, 0.25V Dropout, PMOS, PDSO5; Dropout Voltage1-Nom: 175mV; Input Voltage Absolute-Max: 6V; Package Equivalence Code: TSOP5/6,.11,37; Package Body Material: Plastic; Voltage Tolerance-Max: 2%; Max Supply Voltage: 5.5V; Channels: 1; Dropout Voltage1-Max: 250mV; Regulator Type: FIXED POSITIVE SINGLE OUTPUT LDO REGULATOR; Output Current1-Max: 200mA; Min Input Voltage: 2V; Output Voltage1-Min: 3.234V; Load Regulation-Max: 0.015%; Line Regulation-Max: 0.005%; Output Voltage1-Max: 3.366V; Qualification Status: Not Qualified; Reach SVHC Compliant: Yes; JESD-30 Code: R-PDSO-G5; Terminal Position: DUAL; Pins: 5; Moisture Sensitivity Level: 2; Length: 2.9mm; Operating Temperature, TJ-Min: -40°C; Operating Temperature, TJ-Max: 125°C; Package Shape: Rectangular; Output Voltage1-Nom: 3.3V; Packaging: Tape and Reel; Surface Mount: Yes; Number of Outputs: 1; JESD-609 Code: e4; Adjustability: FIXED; Technology: PMOS; Peak Reflow Temperature (Cel): 260°C; Terminal Form: Gull Wing; Case/Package: TSSOP; Height - Seated (Max): 1.1mm; Package Style: SMALL OUTLINE, THIN PROFILE, SHRINK PITCHMeter; Terminal Finish: Nickel; RoHS Compliant: Yes; Terminal Pitch: 0.95mm; Width: 1.6mm
X1 = ECS-80-18-30-JGN-TR: Crystal 8MHz; Part Number: ECS-80-18-30-JGN-TR; Digikey Link: #https://www.digikey.com.au/en/products/detail/ecs-inc/ECS-80-18-30-JGN-TR/5875530?s=N4IgTCBcDaIKIGEDKBaAHABhQRjSgzFgFIDiAcigCoBKIAugL5A#
X2 = FC-135 32.7680KA-A5: Manufacturer: EPSON; Load Capacitance: 12.5pF; ESR: 70k; Part Number: FC-135 32.7680KA-A5; Value: 32.768kHz; Digikey Part Number: SER4103TR-ND; Digikey Link: https://www.digikey.com/product-detail/en/epson/FC-135-32.7680KA-A5/SER4103TR-ND/5259895

## Sheet Safety Loops.SchDoc
size A4
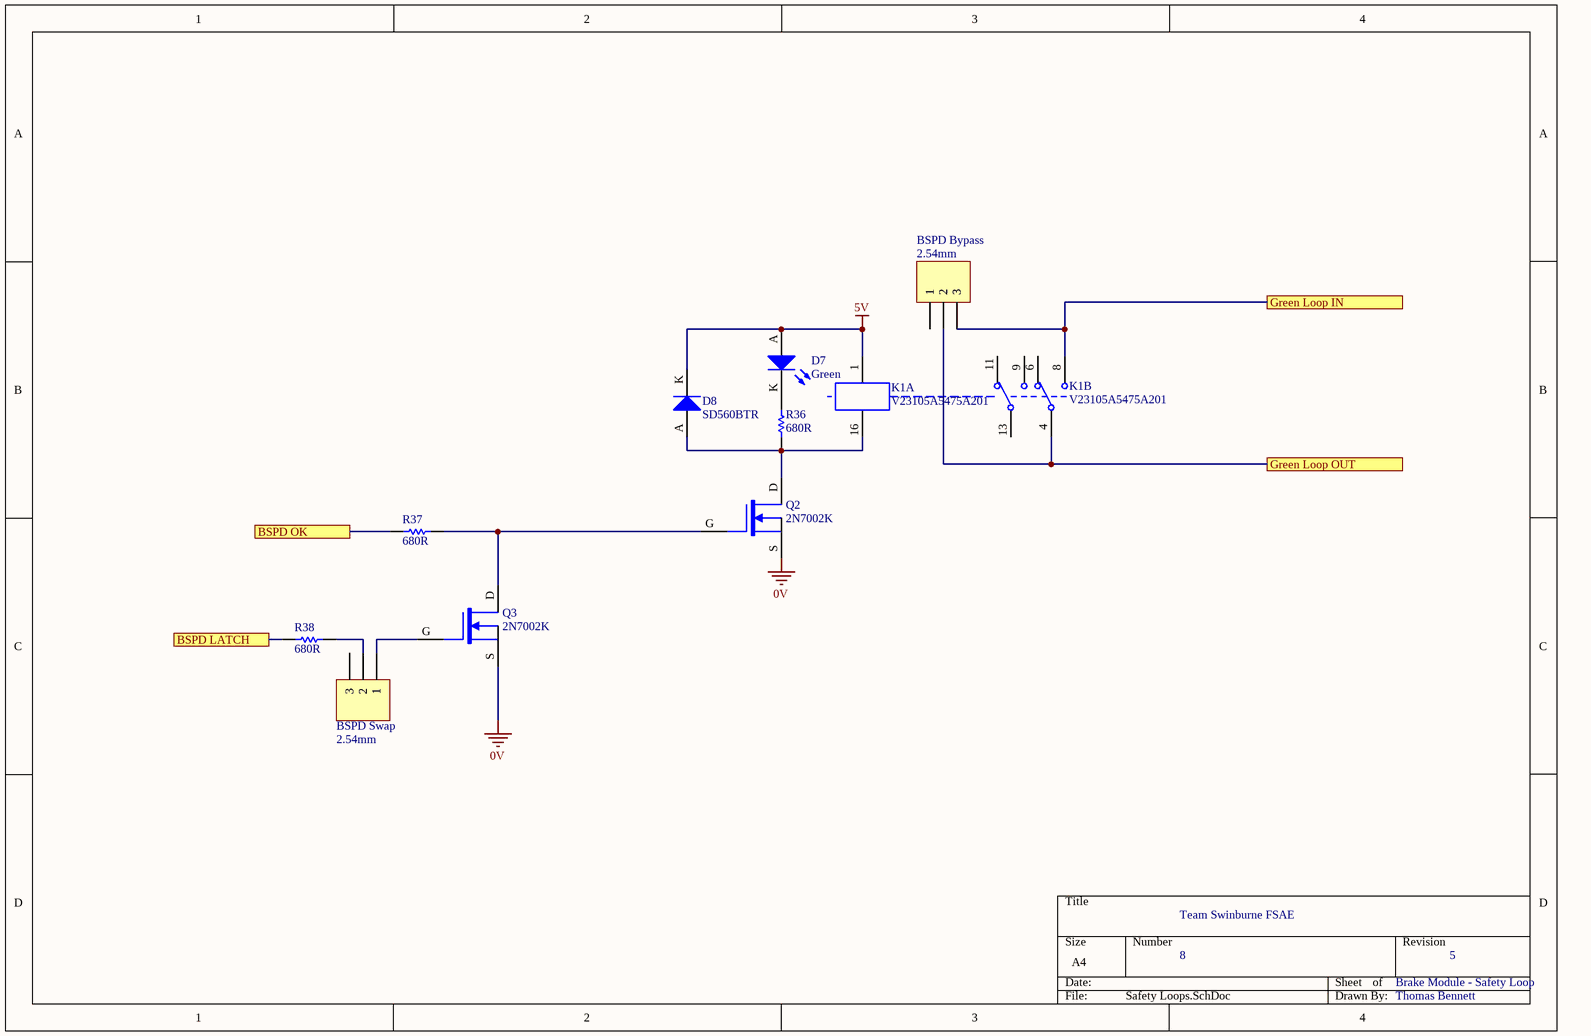
[diagram p3: Safety Loops.SchDoc]

### Parts
BSPD_Bypass  2.54mm  [TH 2.54mm Header 1x3]
BSPD_Swap  2.54mm  [TH 2.54mm Header 1x3]
D7  Green  [0805 LED]
D8  SD560BTR  [SMB Diode]
K1  V23105A5475A201  [TI 2-DIL]  (parts A,B of 2)
Q2  2N7002K  [ON SOT-23 MOSFET]
Q3  2N7002K  [ON SOT-23 MOSFET]
R36  680R  [R0603]
R37  680R  [R0603]
R38  680R  [R0603]

### Ports
BSPD LATCH, BSPD OK, Green Loop IN, Green Loop OUT

### Nets
0V: Q2.S Q3.S
5V: D7.A D8.K K1.1
BSPD DELAY: R38.1 ; port BSPD LATCH
BSPD OK: R37.1 ; port BSPD OK
Green Loop IN: BSPD_Bypass.3 K1.8 ; port Green Loop IN
Green Loop OUT: BSPD_Bypass.2 K1.4 ; port Green Loop OUT
NetBSPD_Swap_1: BSPD_Swap.1 Q3.G
NetBSPD_Swap_2: BSPD_Swap.2 R38.2
NetD7_K: D7.K R36.2
NetD8_A: D8.A K1.16 Q2.D R36.1
NetQ2_G: Q2.G Q3.D R37.2

Not connected (* = marked no-connect by the designer): BSPD_Bypass 1; BSPD_Swap 3; K1 6 9 11 13

### Notes on the sheet
- 8
- Brake Module - Safety Loop

### Library data of the parts
BSPD_Bypass BSPD_Swap = TH 2.54mm Header 1x3: Positions: 3; Angle: 0; Flange: No; Contact: NA; Part Number: TH 2.54mm Header 1x3; Pitch: 2.54mm; Row Spacing: 2.54mm
D7 = SML-210FTT86: Green LED Indication - Discrete 1.75V 0805 (2012 Metric); Manufacturer: ROHM Semiconductor; Part Number: SML-210FTT86; Colour: Green; Digikey Part Number: 511-1285-1-ND; Digikey Link: https://www.digikey.com/product-detail/en/rohm-semiconductor/SML-210FTT86/511-1285-1-ND/637098
D8 = SD560BTR: 1.2V_F 600V 5A SMB; Manufacturer: SMC Diode Solutions; Part Number: SD560BTR; Digikey Part Number: 1655-1530-2-ND; Digikey Link: https://www.digikey.com/product-detail/en/smc-diode-solutions/SD560BTR/1655-1530-2-ND/6022620
K1 = V23105A5475A201: 5V DPDT Relay 3A 220VDC; Manufacturer: Axicom; Part Number: V23105A5475A201; Digikey Part Number: PB383-ND; Digikey Link: https://www.digikey.com/products/en?mpart=V23105A5001A201&v=41
Q2 Q3 = 2N7002K: 60V 380mA, NFET MOSTFET (Small Signal); Manufacturer: ON Semiconductor; Published: 24-Mar-1999; LatestRevisionDate: 29-May-2009; LatestRevisionNote: IPC-7351 Footprint Added.; PackageVersion: Sep-2000; PackageReference: SOT-343; Publisher: Altium Limited; PackageDescription: 4-Pin SOT-343 Package 1.3 mm Pitch, 2.1 mm Lead Span; Part Number: 2N7002K; Digikey Part Number: 2N7002KCT-ND; Digikey Link: https://www.digikey.com/product-detail/en/on-semiconductor/2N7002K/2N7002KCT-ND/2060375; Qty: 30
R36-R38 = RCP0603B680RGEA: Tolerance: 2%; Part Number: RCP0603B680RGEA; Value: 680R; Material: Thick Film; Digikey Link: #https://www.digikey.com.au/en/products/detail/vishay-dale/RCP0603B680RGEA/5791729#

## Sheet Power Supply.SchDoc
size A4
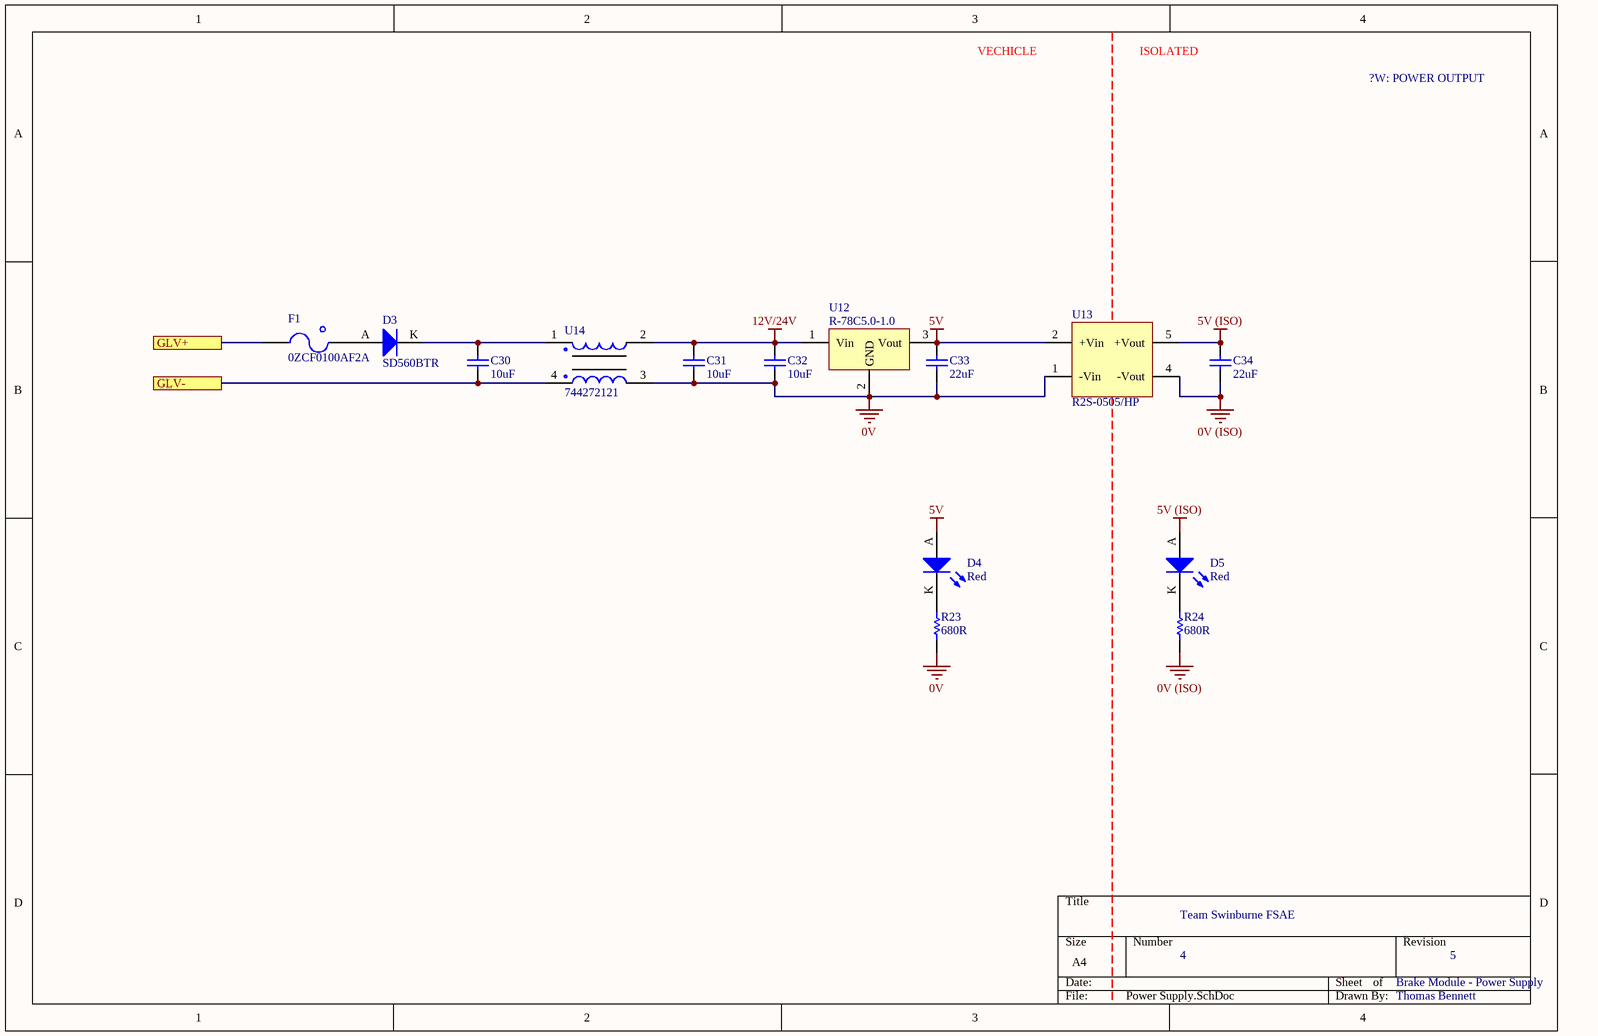
[diagram p4: Power Supply.SchDoc]

### Parts
C30  10uF  [0805]
C31  10uF  [0805]
C32  10uF  [0805]
C33  22uF  [1206]
C34  22uF  [1206]
D3  SD560BTR  [SMB Diode]
D4  Red  [0805 LED]
D5  Red  [0805 LED]
F1  0ZCF0100AF2A  [2920]
R23  680R  [0805]
R24  680R  [0805]
U12  R-78C5.0-1.0  [RECOM 3-SIP]
U13  R2S-0505/HP  [RECOM 8-SMD (5 Pin)]
U14  744272121  [Wurth 4-PC Pad]

### Ports
GLV+, GLV-

### Nets
0V: C31.1 C32.1 C33.1 R23.1 U12.2(GND) U13.1(-Vin) U14.3
0V (ISO): C34.1 R24.1 U13.4(-Vout)
5V: C33.2 D4.A U12.3(Vout) U13.2(+Vin)
5V (ISO): C34.2 D5.A U13.5(+Vout)
12V/24V: C31.2 C32.2 U12.1(Vin) U14.2
GLV+: F1.1 ; port GLV+
GLV-: C30.1 U14.4 ; port GLV-
NetC30_2: C30.2 D3.K U14.1
NetD3_A: D3.A F1.2
NetD4_K: D4.K R23.2
NetD5_K: D5.K R24.2

### Notes on the sheet
- VECHICLE
- ISOLATED
- ?W: POWER OUTPUT
- 4
- Brake Module - Power Supply
- (in symbol GRM21BR6YA106KE43L) 0805

### Library data of the parts
C30-C32 = GRM21BR6YA106KE43L: Manufacturer: muRata; Tolerance: 10%; Material: X5R; Rated Voltage: 50V; Part Number: GRM21BR6YA106KE43L; Value: 10uF; Digikey Part Number: 490-10514-6-ND
C33 C34 = CC1206MKX5R7BB226: Manufacturer: YAGEO; Tolerance: 20%; Material: Ceramic; Rated Voltage: 16V; Part Number: CC1206MKX5R7BB226; Value: 22uF; Digikey Part Number: 311-1997-2-ND
D3 = SD560BTR: as D8 on sheet Safety Loops; Part Number: SD560BTR; Digikey Part Number: 1655-1530-2-ND; Digikey Link: https://www.digikey.com/product-detail/en/smc-diode-solutions/SD560BTR/1655-1530-2-ND/6022620
D4 D5 = SML-210LTT86: as D6 on sheet Microcontroller; Part Number: SML-210LTT86; Colour: Red; Digikey Part Number: 511-1286-1-ND; Digikey Link: https://www.digikey.com/product-detail/en/rohm-semiconductor/SML-210LTT86/511-1286-1-ND/637099
F1 = 0ZCF0100AF2A: PTC RESET FUSE 60V 1A 292; Manufacturer: Littelfuse Inc.; Part Number: 0ZCF0100AF2A; Digikey Part Number: 507-2070-1-ND; Digikey Link: https://www.digikey.com/product-detail/en/bel-fuse-inc/0ZCF0100AF2A/507-2070-1-ND/6210547
R23 R24 = RC0805FR07680RL: Manufacturer: YAGEO; Tolerance: 0.01; Rated Voltage: 0.125W; Part Number: RC0805FR07680RL; Value: 680R; Material: FR-07; Digikey Part Number: 311-680CRCT-ND
U12 = R-78C5.0-1.0: CONV DC/DC 1A 5V OUT SIP VERT; Manufacturer: Recom; Isolation: Non-Isolated; Output Power: 5W; Part Number: R-78C5.0-1.0; Digikey Part Number: 945-1395-5-ND; Digikey Link: https://www.digikey.com.au/product-detail/en/recom-power/R-78C5.0-1.0/945-1395-5-ND/2652148; Output Voltage: 5V
U13 = R2S-0505/HP: Isolated Module DC DC Converter 1 Output 3.3V 606mA 4.5V - 5.5V Input; Manufacturer: Recom; Output Voltage: 5V; Output Power: 2W; Efficiency: 0.85; Part Number: R2S-0505/HP; Input Voltage: 4.5V-5.5V; Isolation: Isolated; Digikey Part Number: 945-1764-5-ND; Digikey Link: https://www.digikey.com/product-detail/en/recom-power/R2S-0505-HP/945-1764-5-ND/2302761
U14 = 744272121: 120µH @ 100kHz 2 Line Common Mode Choke Surface Mount 460 Ohms @ 30MHz 2.5A DCR 25mOhm; Manufacturer: Wurth Electronics Inc; Value: 120uH @ 100kHz; Part Number: 744272121; Impedence: 460 Ohms @ 30MHz; Material: Wirewound; Rated Current: 2.5A; Digikey Part Number: 732-1489-1-ND; Digikey Link: https://www.digikey.com/product-detail/en/w-rth-elektronik/744272121/732-1489-1-ND/1639501

## Sheet CAN.SchDoc
size A4
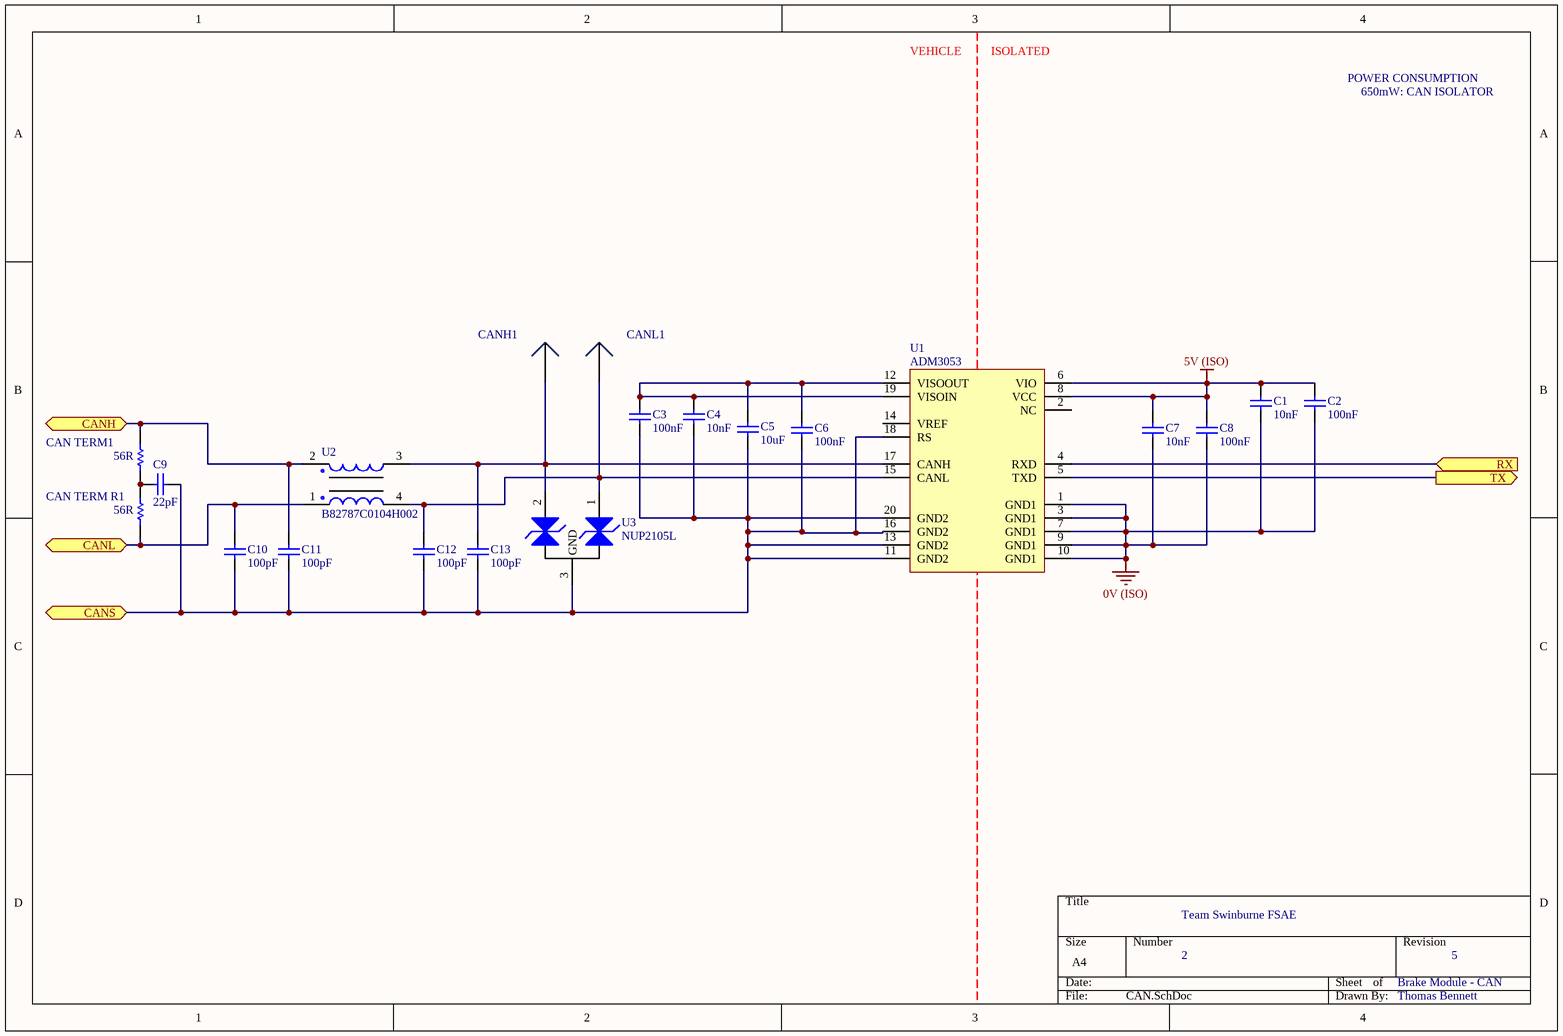
[diagram p5: CAN.SchDoc]

### Parts
C1  10nF  [C0603]
C2  100nF  [C0603]
C3  100nF  [C0603]
C4  10nF  [C0603]
C5  10uF  [C0603]
C6  100nF  [C0603]
C7  10nF  [C0603]
C8  100nF  [C0603]
C9  22pF  [0805]
C10  100pF  [C0603]
C11  100pF  [C0603]
C12  100pF  [C0603]
C13  100pF  [C0603]
CAN_TERM1  56R  [0805]
CAN_TERM_R1  56R  [0805]
CANH1  0mm  [SMD Test Point]  (value not drawn)
CANL1  0mm  [SMD Test Point]  (value not drawn)
U1  ADM3053  [AD SOIC-W 20]
U2  B82787C0104H002  [TDK 4-PC Pad]
U3  NUP2105L  [ON SOT-23]

### Ports
CANH (bidir), CANL (bidir), CANS (bidir), RX (in), TX (out)

### Nets
0V (ISO): C1.1 C2.1 C7.1 C8.1 U1.1(GND1) U1.3(GND1) U1.7(GND1) U1.9(GND1) U1.10(GND1)
5V (ISO): C1.2 C2.2 C7.2 C8.2 U1.6(VIO) U1.8(VCC)
CANH_P: C11.2 CAN_TERM1.2 U2.2 ; port CANH
CANL_N: C10.2 CAN_TERM_R1.1 U2.1 ; port CANL
CANS: C3.1 C4.1 C5.1 C6.1 C9.2 C10.1 C11.1 C12.1 C13.1 U1.11(GND2) U1.13(GND2) U1.16(GND2) U1.18(RS) U1.20(GND2) U3.3(GND) ; port CANS
NetC3_2: C3.2 C4.2 C5.2 C6.2 U1.12(VISOOUT) U1.19(VISOIN)
NetC9_1: C9.1 CAN_TERM1.1 CAN_TERM_R1.2
NetC12_2: C12.2 CANL1.1 U1.15(CANL) U2.4 U3.1(CAN_H)
NetC13_2: C13.2 CANH1.1 U1.17(CANH) U2.3 U3.2(CAN_L)
NetU1_4: U1.4(RXD) ; port RX
NetU1_5: U1.5(TXD) ; port TX

Not connected (* = marked no-connect by the designer): U1 2(NC) 14(VREF)

### Notes on the sheet
- VEHICLE
- ISOLATED
- POWER CONSUMPTION
- 650mW: CAN ISOLATOR
- 2
- Brake Module - CAN

### Library data of the parts
C1 C4 C7 = CC0603JPX7R9BB103: Tolerance: 5%; Material: C0G; Rated Voltage: 50V; Part Number: CC0603JPX7R9BB103; Value: 10nF; Digikey Link: #https://www.digikey.com.au/en/products/detail/yageo/CC0603JPX7R9BB103/11490710#
C2 C3 C6 C8 = CC0603ZPY5V9BB104: as C14 on sheet BSPD; Part Number: CC0603ZPY5V9BB104; Value: 100nF; Digikey Link: #https://www.digikey.com.au/en/products/detail/yageo/CC0603ZPY5V9BB104/11490657#
C5 = GRM188R6YA106MA73D: as C15 on sheet BSPD; Part Number: GRM188R6YA106MA73D; Value: 10uF; Digikey Link: #https://www.digikey.com.au/en/products/detail/murata-electronics/GRM188R6YA106MA73D/5877411#
C9 = GRM21A5C2E220JW01D: Manufacturer: muRata; Tolerance: ±5%; Material: C0G, NP0; Rated Voltage: 250V; Part Number: GRM21A5C2E220JW01D; Value: 22pF; Digikey Part Number: 490-5534-1-ND
C10-C13 = CC0603JPNPO9BN101: Tolerance: 5%; Material: C0G; Rated Voltage: 50V; Part Number: CC0603JPNPO9BN101; Value: 100pF; Digikey Link: #https://www.digikey.com.au/en/products/detail/yageo/CC0603JPNPO9BN101/11490847#
CAN_TERM1 CAN_TERM_R1 = RC0805FR0756RL: Manufacturer: YAGEO; Tolerance: 0.01; Rated Voltage: 0.125W; Part Number: RC0805FR0756RL; Value: 56R; Material: FR-07; Digikey Part Number: 311-56.0CRCT-ND
CANH1 CANL1 = SMD Test Point: as 5kW on sheet BSPD; Part Number: SMD Test Point; Pitch: 0mm; Angle: 0
U1 = ADM3053: Isolated CAN Transceiver; Manufacturer: Analogue Devices; Part Number: ADM3053; Digikey Part Number: ADM3053BRWZ-ND; Digikey Link: https://www.digikey.com/product-detail/en/analog-devices-inc/ADM3053BRWZ/ADM3053BRWZ-ND/2709332
U2 = B82787C0104H002: 100µH @ 100kHz 2 Line Common Mode Choke Surface Mount 5.8 kOhms @ 10MHz 150mA DCR 2Ohm; Manufacturer: EPCOS (TDK); Part Number: B82787C0104H002; Impedence: 5.8 kOhms @ 10MHz; Material: Wirewound; Rated Current: 150mA; Digikey Part Number: 495-4598-1-ND; Digikey Link: https://www.digikey.com/product-detail/en/epcos-tdk/B82787C0104H002/495-4598-2-ND/3680998; Value: 100µH @ 100kHz
U3 = NUP2105L: Dual Line CAN Bus Protector; Manufacturer: ON Semiconductor; Part Number: NUP2105L; Digikey Part Number: NUP2105LT1GOSCT-ND; Digikey Link: https://www.digikey.com/product-detail/en/on-semiconductor/NUP2105LT1G/NUP2105LT1GOSCT-ND/1485001

## Sheet Input Filter.SchDoc
size A4
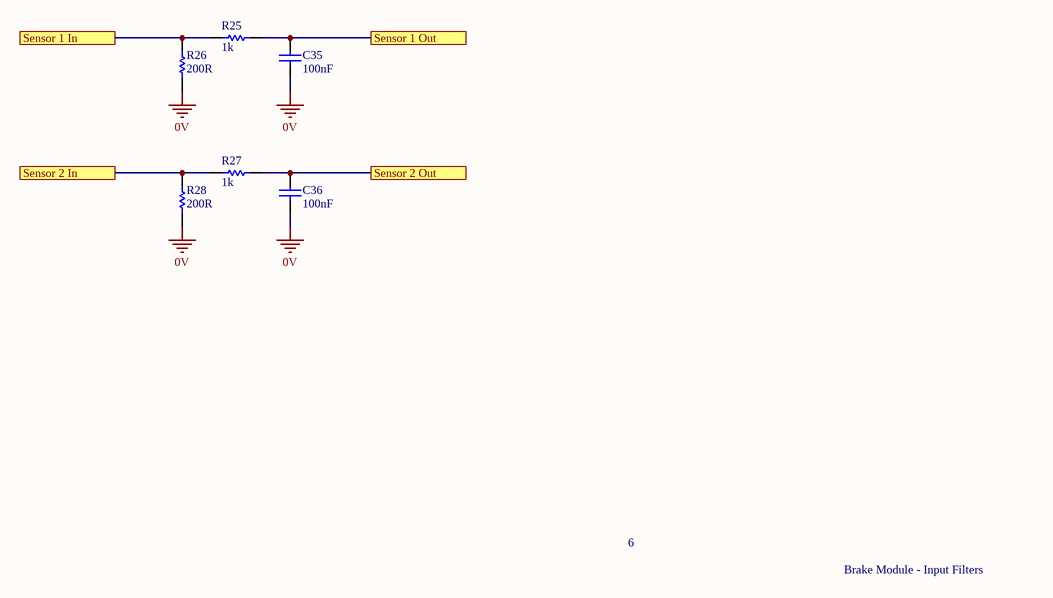
[diagram p6: Input Filter.SchDoc]

### Parts
C35  100nF  [0805]
C36  100nF  [0805]
R25  1k  [0805]
R26  200R  [0805]
R27  1k  [0805]
R28  200R  [0805]

### Ports
Sensor 1 In, Sensor 1 Out, Sensor 2 In, Sensor 2 Out

### Nets
0V: C35.1 C36.1 R26.1 R28.1
Brake Signal 1: C35.2 R25.2 ; port Sensor 1 Out
Brake Signal 2: C36.2 R27.2 ; port Sensor 2 Out
Sensor 1 IN: R25.1 R26.2 ; port Sensor 1 In
Sensor 2 IN: R27.1 R28.2 ; port Sensor 2 In

### Notes on the sheet
- 6
- Brake Module - Input Filters

### Library data of the parts
C35 C36 = GCM21BR71H104KA37L: as C27 on sheet BSPD; Part Number: GCM21BR71H104KA37L; Value: 100nF; Digikey Part Number: 490-6064-1-ND
R25 R27 = RC0805FR071KL: Manufacturer: YAGEO; Tolerance: 0.01; Rated Voltage: 0.125W; Part Number: RC0805FR071KL; Value: 1k; Material: FR-07; Digikey Part Number: 311-1.00KCRCT-ND
R26 R28 = RC0805FR07200RL: Manufacturer: YAGEO; Tolerance: 0.01; Rated Voltage: 0.125W; Part Number: RC0805FR07200RL; Value: 200R; Material: FR-07; Digikey Part Number: 311-200CRCT-ND

## Nets that join several sheets
0V: Top Level (PWR_SEL.6), BSPD (37 pins), Safety Loops (Q2.S Q3.S), Power Supply (7 pins), Input Filter (C35.1 C36.1 R26.1 R28.1)
0V (ISO): BSPD (9 pins), Microcontroller (23 pins), Power Supply (C34.1 R24.1 U13.4), CAN (9 pins)
5V: Top Level (PWR_SEL.5), BSPD (34 pins), Safety Loops (D7.A D8.K K1.1), Power Supply (C33.2 D4.A U12.3 U13.2)
5V (ISO): BSPD (13 pins), Microcontroller (C38.2 C40.2 U16.1 U16.3), Power Supply (C34.2 D5.A U13.5), CAN (6 pins)
GLV+: Top Level (PWR_SEL.1 Universal_Plug1.12), Power Supply (F1.1)
GLV-: Top Level (PWR_SEL.2 Universal_Plug1.11), Power Supply (C30.1 U14.4)
5kW: Top Level (Universal_Plug1.8), BSPD (5kW.1 U6.3 U10.4)
Brake Signal 1: BSPD (ADC1.3 U11.4 U11.7), Input Filter (C35.2 R25.2)
Brake Signal 2: BSPD (ADC1.1 U11.8 U11.11), Input Filter (C36.2 R27.2)
BSPD DELAY: BSPD (R6.2 U4.9 U5.3), Safety Loops (R38.1)
BSPD OK: BSPD (6 pins), Safety Loops (R37.1)
CANH_P: Top Level (Universal_Plug1.5), CAN (C11.2 CAN_TERM1.2 U2.2)
CANL_N: Top Level (Universal_Plug1.4), CAN (C10.2 CAN_TERM_R1.1 U2.1)
CANS: Top Level (Universal_Plug1.1), CAN (15 pins)
Green Loop IN: Top Level (Universal_Plug1.10), Safety Loops (BSPD_Bypass.3 K1.8)
Green Loop OUT: Top Level (Universal_Plug1.9), Safety Loops (BSPD_Bypass.2 K1.4)
NetR13_1: BSPD (R13.1 U7.6), Microcontroller (U15.40)
NetR14_1: BSPD (R14.1 U7.5), Microcontroller (U15.41)
NetR15_1: BSPD (R15.1 U7.3), Microcontroller (U15.39)
NetR16_1: BSPD (R16.1 U7.4), Microcontroller (U15.42)
NetU1_4: Microcontroller (U15.45), CAN (U1.4)
NetU1_5: Microcontroller (U15.46), CAN (U1.5)
NetU5_11: BSPD (U5.11), Microcontroller (U15.27)
NetU5_13: BSPD (U5.13), Microcontroller (U15.26)
NetU5_14: BSPD (U5.14), Microcontroller (U15.25)
NetU6_11: BSPD (U6.11), Microcontroller (U15.29)
NetU6_13: BSPD (U6.13), Microcontroller (U15.31)
NetU6_14: BSPD (U6.14), Microcontroller (U15.32)
Sensor 1 IN: Top Level (Sensors_Plug1.5), Input Filter (R25.1 R26.2)
Sensor 2 IN: Top Level (Sensors_Plug1.2), Input Filter (R27.1 R28.2)